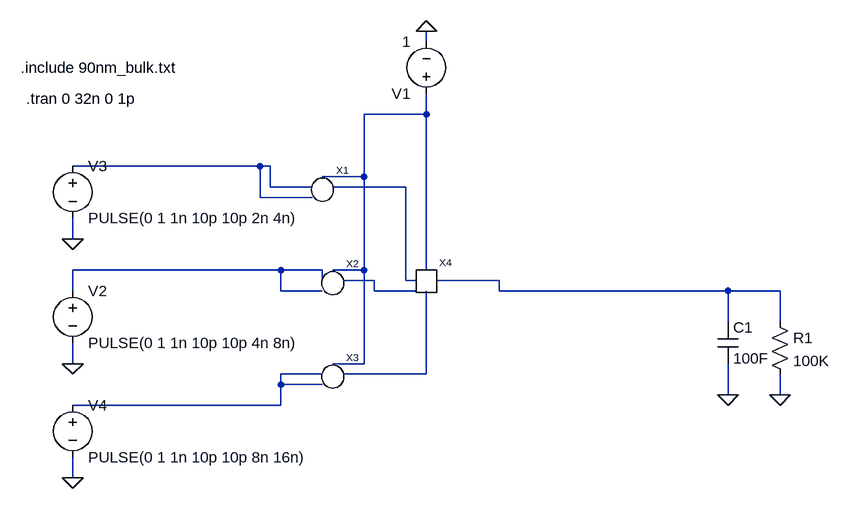
[diagram p0: schematic Final2.asc]
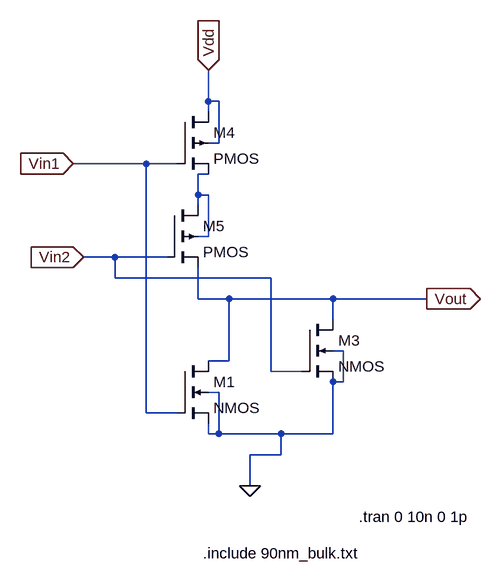
[diagram p1: sub-circuit nor.asc]
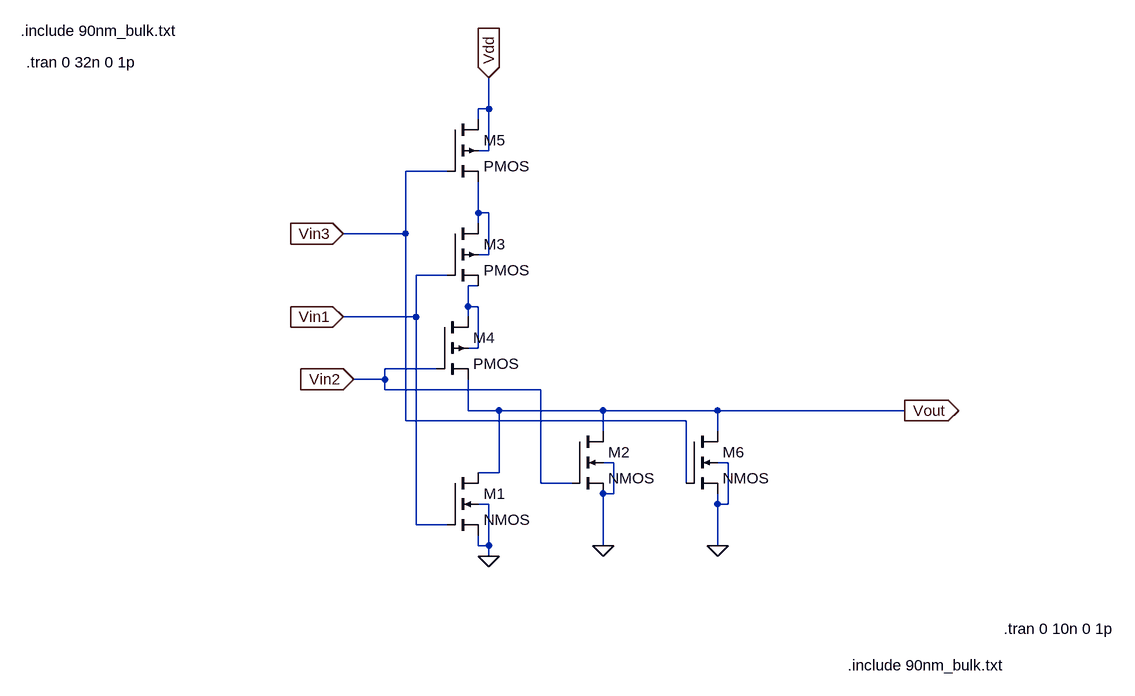
[diagram p2: sub-circuit nor3.asc]
Final2.asc, the LTspice schematic file:
Version 4
SHEET 1 968 680
WIRE 336 -128 336 -144
WIRE 336 -16 336 -48
WIRE 336 -16 240 -16
WIRE 80 64 -208 64
WIRE 96 64 80 64
WIRE 240 80 240 -16
WIRE 240 80 176 80
WIRE 96 96 96 64
WIRE 160 96 96 96
WIRE 304 96 192 96
WIRE 80 112 80 64
WIRE 160 112 80 112
WIRE -208 176 -208 144
WIRE 112 224 -208 224
WIRE 176 224 112 224
WIRE 240 224 240 80
WIRE 240 224 192 224
WIRE 336 224 336 -16
WIRE 176 240 176 224
WIRE 256 240 208 240
WIRE 304 240 304 96
WIRE 320 240 304 240
WIRE 448 240 352 240
WIRE -208 256 -208 224
WIRE 112 256 112 224
WIRE 176 256 112 256
WIRE 256 256 256 240
WIRE 320 256 256 256
WIRE 448 256 448 240
WIRE 800 256 448 256
WIRE 880 256 800 256
WIRE 800 304 800 256
WIRE 880 304 880 256
WIRE -208 368 -208 336
WIRE 240 368 240 224
WIRE 240 368 192 368
WIRE 176 384 112 384
WIRE 336 384 336 256
WIRE 336 384 208 384
WIRE 112 400 112 384
WIRE 176 400 112 400
WIRE 800 416 800 368
WIRE 880 416 880 384
WIRE 112 432 112 400
WIRE 112 432 -208 432
WIRE -208 544 -208 512
FLAG 336 -144 0
FLAG -208 176 0
FLAG -208 368 0
FLAG 800 416 0
FLAG 880 416 0
FLAG -208 544 0
SYMBOL voltage 336 -32 R180
WINDOW 123 0 0 Left 2
WINDOW 39 0 0 Left 2
SYMATTR InstName V1
SYMATTR Value 1
SYMBOL res 864 288 R0
SYMATTR InstName R1
SYMATTR Value 100K
SYMBOL cap 784 304 R0
SYMATTR InstName C1
SYMATTR Value 100F
SYMBOL voltage -208 240 R0
WINDOW 123 0 0 Left 2
WINDOW 39 0 0 Left 2
SYMATTR InstName V2
SYMATTR Value PULSE(0 1 1n 10p 10p 4n 8n)
SYMBOL voltage -208 48 R0
WINDOW 123 0 0 Left 2
WINDOW 39 0 0 Left 2
SYMATTR InstName V3
SYMATTR Value PULSE(0 1 1n 10p 10p 2n 4n)
SYMBOL voltage -208 416 R0
WINDOW 123 0 0 Left 2
WINDOW 39 0 0 Left 2
SYMATTR InstName V4
SYMATTR Value PULSE(0 1 1n 10p 10p 8n 16n)
SYMBOL nor 192 96 R0
SYMATTR InstName X1
SYMBOL nor 208 240 R0
SYMATTR InstName X2
SYMBOL nor 208 384 R0
SYMATTR InstName X3
SYMBOL nor3 352 240 R0
SYMATTR InstName X4
TEXT -288 -88 Left 2 !.include 90nm_bulk.txt
TEXT -280 -40 Left 2 !.tran 0 32n 0 1p

nor.asc, the sub-circuit schematic file:
Version 4
SHEET 1 968 680
WIRE -160 -432 -160 -480
WIRE -144 -432 -160 -432
WIRE -160 -416 -160 -432
WIRE -144 -368 -144 -432
WIRE -144 -368 -160 -368
WIRE -256 -336 -368 -336
WIRE -208 -336 -256 -336
WIRE -160 -320 -176 -320
WIRE -176 -288 -176 -320
WIRE -160 -288 -176 -288
WIRE -176 -272 -176 -288
WIRE -160 -224 -160 -288
WIRE -160 -224 -176 -224
WIRE -304 -192 -352 -192
WIRE -224 -192 -304 -192
WIRE -304 -160 -304 -192
WIRE -64 -160 -304 -160
WIRE -176 -128 -176 -176
WIRE -128 -128 -176 -128
WIRE 32 -128 -128 -128
WIRE 176 -128 32 -128
WIRE 32 -96 32 -128
WIRE 48 -48 32 -48
WIRE -128 -32 -128 -128
WIRE -128 -32 -160 -32
WIRE -64 -16 -64 -160
WIRE -16 -16 -64 -16
WIRE 48 0 48 -48
WIRE 48 0 32 0
WIRE -144 16 -160 16
WIRE -256 48 -256 -336
WIRE -208 48 -256 48
WIRE -160 80 -160 64
WIRE -144 80 -144 16
WIRE -144 80 -160 80
WIRE -48 80 -144 80
WIRE 32 80 32 0
WIRE 32 80 -48 80
WIRE -48 112 -48 80
WIRE -48 112 -96 112
WIRE -96 160 -96 112
FLAG -368 -336 Vin1
IOPIN -368 -336 In
FLAG -352 -192 Vin2
IOPIN -352 -192 In
FLAG -96 160 0
FLAG 176 -128 Vout
IOPIN 176 -128 Out
FLAG -160 -480 Vdd
IOPIN -160 -480 In
SYMBOL nmos4 -208 -32 R0
SYMATTR InstName M1
SYMATTR Value2 l=90n w=200n
SYMBOL nmos4 -16 -96 R0
SYMATTR InstName M3
SYMATTR Value2 l=90n w=200n
SYMBOL pmos4 -208 -416 R0
SYMATTR InstName M4
SYMATTR Value2 l=90n w=400n
SYMBOL pmos4 -224 -272 R0
SYMATTR InstName M5
SYMATTR Value2 l=90n w=400n
TEXT -168 264 Left 2 !.include 90nm_bulk.txt
TEXT 72 208 Left 2 !.tran 0 10n 0 1p

nor3.asc, the sub-circuit schematic file:
Version 4
SHEET 1 968 680
WIRE -720 -592 -720 -640
WIRE -720 -592 -736 -592
WIRE -736 -576 -736 -592
WIRE -720 -528 -720 -592
WIRE -720 -528 -736 -528
WIRE -784 -496 -848 -496
WIRE -736 -432 -736 -480
WIRE -720 -432 -736 -432
WIRE -736 -416 -736 -432
WIRE -848 -400 -848 -496
WIRE -848 -400 -944 -400
WIRE -720 -368 -720 -432
WIRE -720 -368 -736 -368
WIRE -784 -336 -832 -336
WIRE -736 -320 -752 -320
WIRE -752 -288 -752 -320
WIRE -736 -288 -752 -288
WIRE -832 -272 -832 -336
WIRE -832 -272 -944 -272
WIRE -752 -272 -752 -288
WIRE -736 -224 -736 -288
WIRE -736 -224 -752 -224
WIRE -800 -192 -880 -192
WIRE -880 -176 -880 -192
WIRE -880 -176 -928 -176
WIRE -880 -160 -880 -176
WIRE -640 -160 -880 -160
WIRE -752 -128 -752 -176
WIRE -704 -128 -752 -128
WIRE -544 -128 -704 -128
WIRE -368 -128 -544 -128
WIRE -80 -128 -368 -128
WIRE -848 -112 -848 -400
WIRE -416 -112 -848 -112
WIRE -544 -96 -544 -128
WIRE -368 -96 -368 -128
WIRE -528 -48 -544 -48
WIRE -352 -48 -368 -48
WIRE -704 -32 -704 -128
WIRE -704 -32 -736 -32
WIRE -640 -16 -640 -160
WIRE -592 -16 -640 -16
WIRE -416 -16 -416 -112
WIRE -528 0 -528 -48
WIRE -528 0 -544 0
WIRE -720 16 -736 16
WIRE -368 16 -368 0
WIRE -352 16 -352 -48
WIRE -352 16 -368 16
WIRE -832 48 -832 -272
WIRE -784 48 -832 48
WIRE -736 80 -736 64
WIRE -720 80 -720 16
WIRE -720 80 -736 80
WIRE -544 80 -544 0
WIRE -368 80 -368 16
WIRE -720 96 -720 80
FLAG -944 -272 Vin1
IOPIN -944 -272 In
FLAG -928 -176 Vin2
IOPIN -928 -176 In
FLAG -80 -128 Vout
IOPIN -80 -128 Out
FLAG -720 -640 Vdd
IOPIN -720 -640 In
FLAG -944 -400 Vin3
IOPIN -944 -400 In
FLAG -368 80 0
FLAG -544 80 0
FLAG -720 96 0
SYMBOL nmos4 -784 -32 R0
SYMATTR InstName M1
SYMATTR Value2 l=90n w=200n
SYMBOL nmos4 -592 -96 R0
SYMATTR InstName M2
SYMATTR Value2 l=90n w=200n
SYMBOL pmos4 -784 -416 R0
SYMATTR InstName M3
SYMATTR Value2 l=90n w=400n
SYMBOL pmos4 -800 -272 R0
SYMATTR InstName M4
SYMATTR Value2 l=90n w=400n
SYMBOL pmos4 -784 -576 R0
SYMATTR InstName M5
SYMATTR Value2 l=90n w=400n
SYMBOL nmos4 -416 -96 R0
SYMATTR InstName M6
SYMATTR Value2 l=90n w=200n
TEXT -168 264 Left 2 !.include 90nm_bulk.txt
TEXT 72 208 Left 2 !.tran 0 10n 0 1p
TEXT -1440 -712 Left 2 !.include 90nm_bulk.txt
TEXT -1432 -664 Left 2 !.tran 0 32n 0 1p

The netlist it stands for:
* Final2.asc
V1 N001 0 1
R1 N006 0 100K
C1 N006 0 100F
V2 N004 0 PULSE(0 1 1n 10p 10p 4n 8n)
V3 N002 0 PULSE(0 1 1n 10p 10p 2n 4n)
V4 N007 0 PULSE(0 1 1n 10p 10p 8n 16n)
XX1 N002 N002 N001 N003 nor
XX2 N004 N004 N001 N005 nor
XX3 N007 N007 N001 N008 nor
XX4 N003 N005 N001 N006 N008 nor3

* block symbol definitions
.subckt nor Vin1 Vin2 Vdd Vout
M1 Vout Vin1 0 0 NMOS l=90n w=200n
M3 Vout Vin2 0 0 NMOS l=90n w=200n
M4 Vdd Vin1 N001 Vdd PMOS l=90n w=400n
M5 N001 Vin2 Vout N001 PMOS l=90n w=400n
.include 90nm_bulk.txt
.tran 0 10n 0 1p
.ends nor

.subckt nor3 Vin1 Vin2 Vdd Vout Vin3
M1 Vout Vin1 0 0 NMOS l=90n w=200n
M2 Vout Vin2 0 0 NMOS l=90n w=200n
M3 N001 Vin1 N002 N001 PMOS l=90n w=400n
M4 N002 Vin2 Vout N002 PMOS l=90n w=400n
M5 Vdd Vin3 N001 Vdd PMOS l=90n w=400n
M6 Vout Vin3 0 0 NMOS l=90n w=200n
.include 90nm_bulk.txt
.tran 0 10n 0 1p
.include 90nm_bulk.txt
.tran 0 32n 0 1p
.ends nor3

.model NMOS NMOS
.model PMOS PMOS
.lib standard.mos
.include 90nm_bulk.txt
.tran 0 32n 0 1p
.backanno
.end